# EasyEDA Pro project MINI_FOC.eprj

# Schematic Schematic1
Create Date: 2023-01-16; Page Name: P1; Project Name: MINI_FOC; Schematic Name: Schematic1; Update Date: 2023-01-17; Company: 嘉立创EDA; Page Size: A4; Version: V1.0
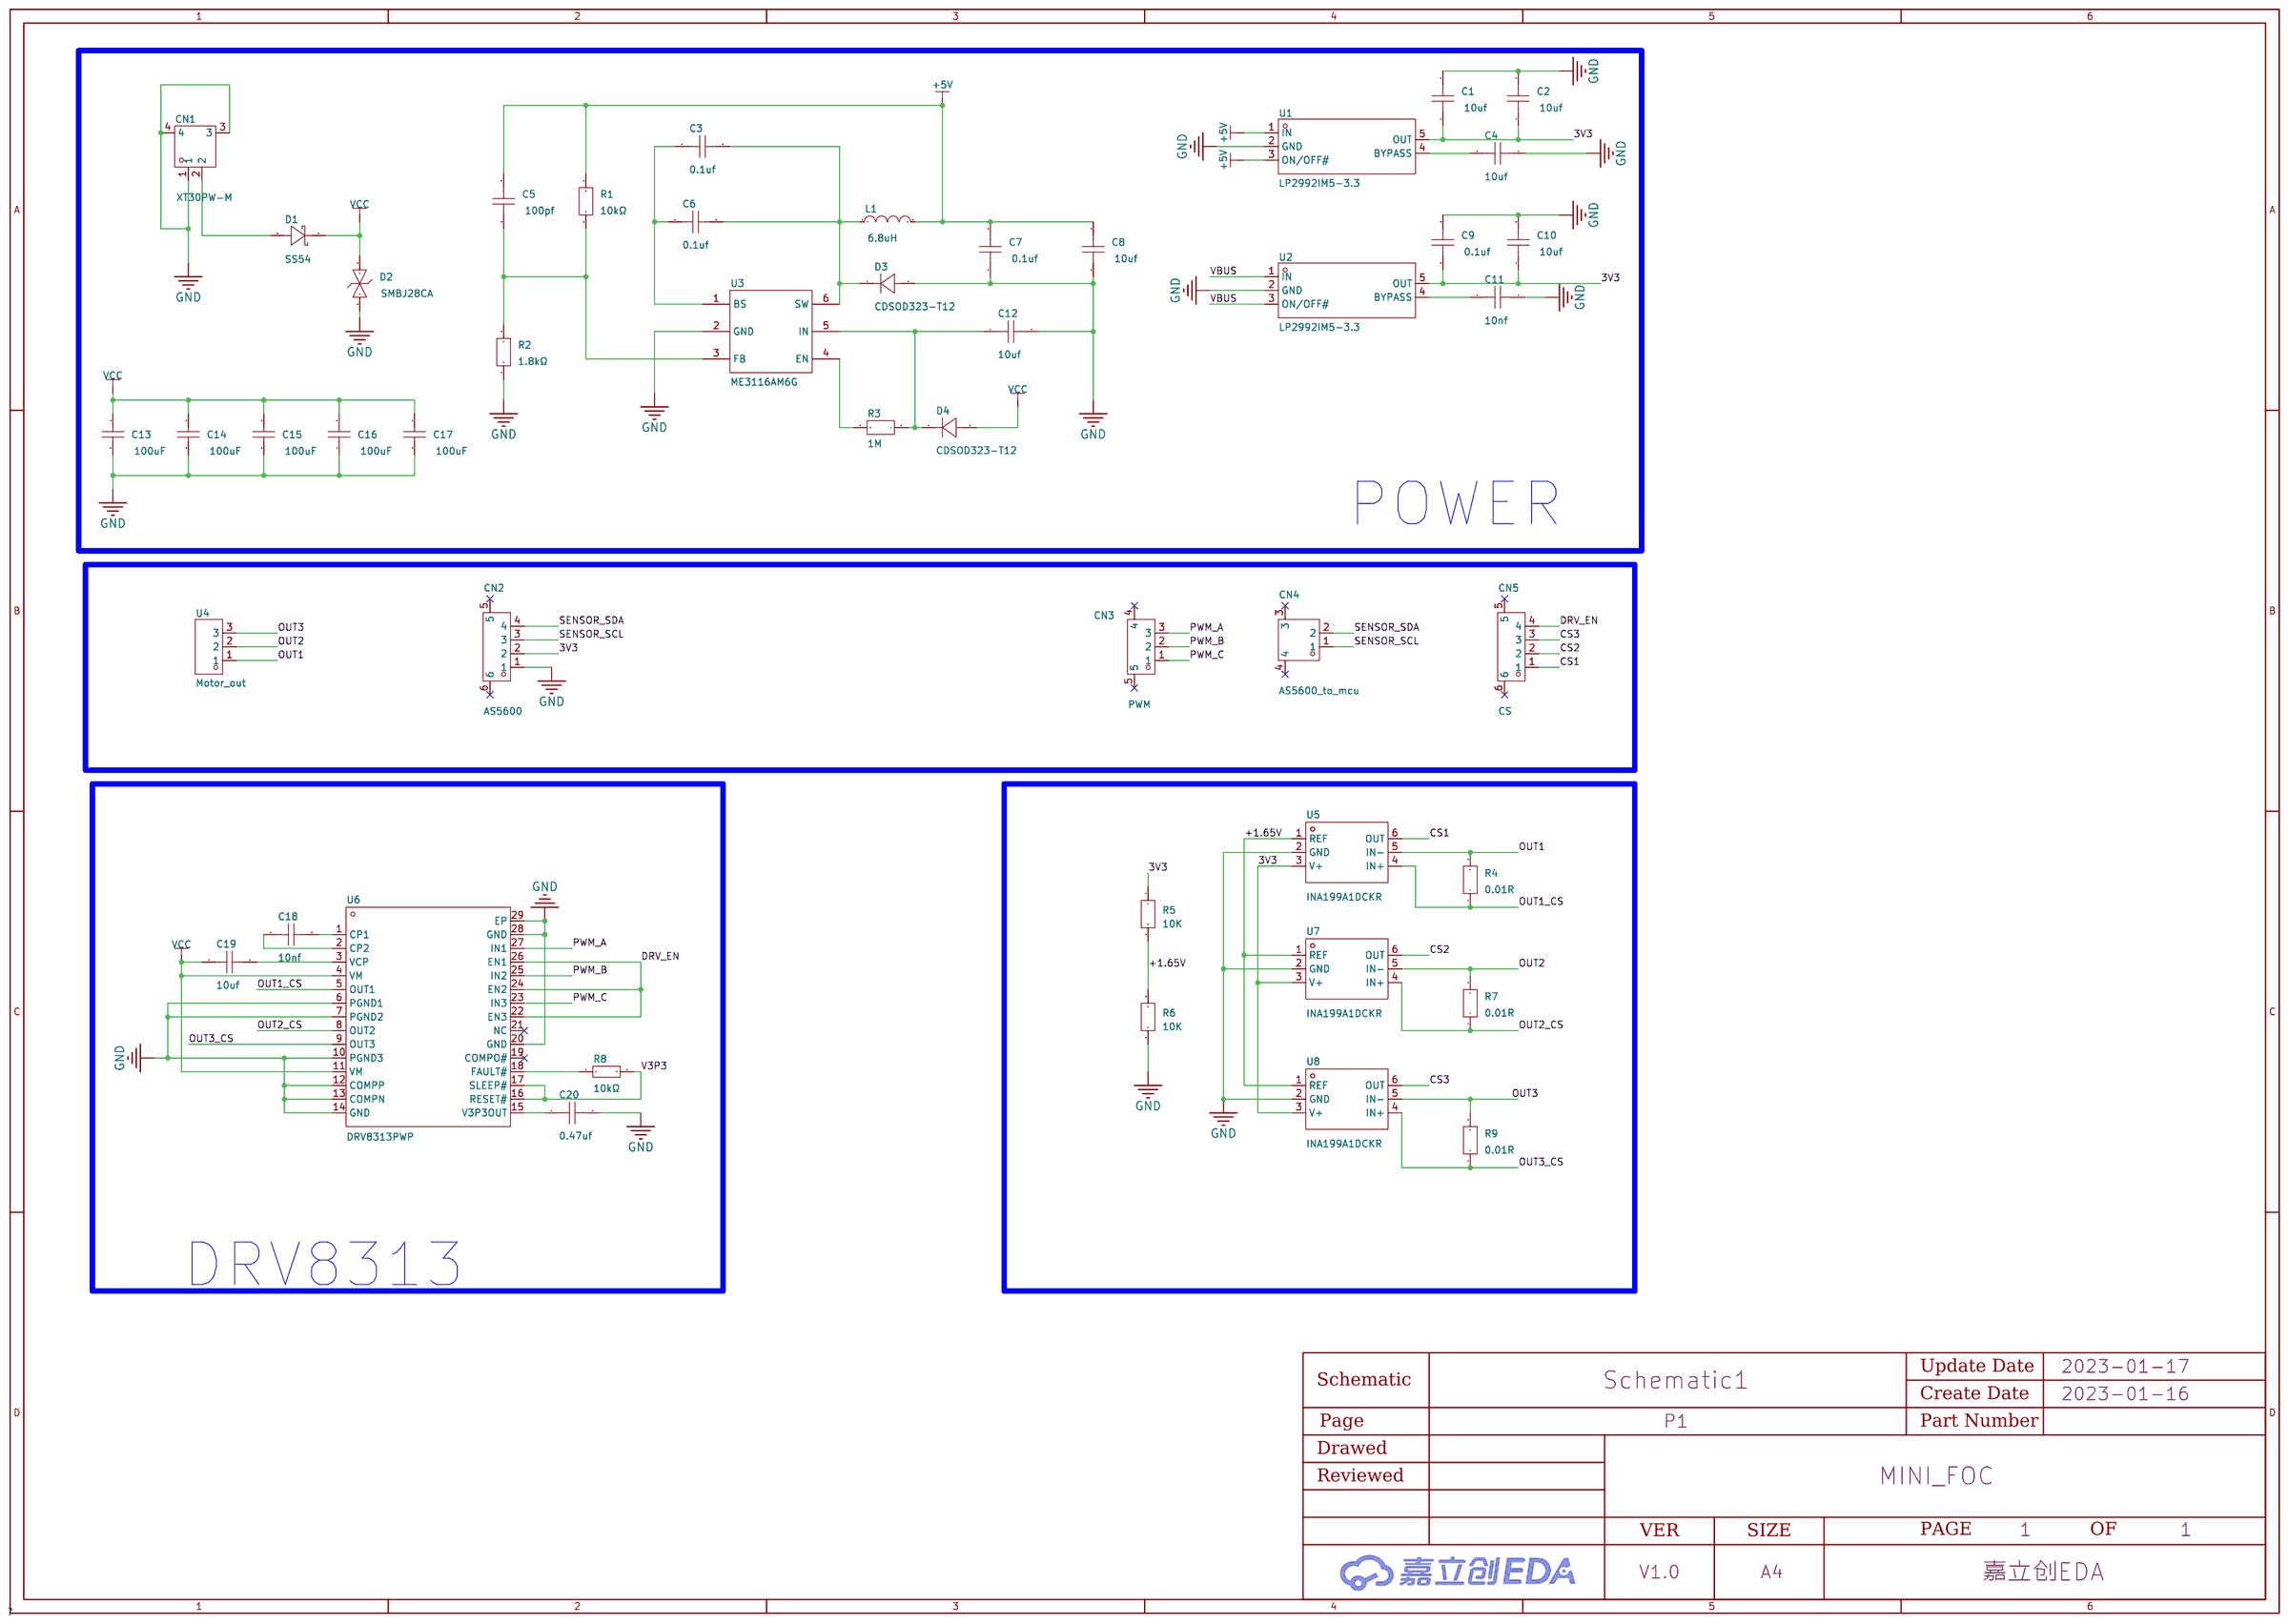
[diagram p0: schematic sheet]

## Parts
C1  10uf  [C0603]
C2  10uf  [C0603]
C3  0.1uf  [C0603]
C4  10uf  [C0603]
C5  100pf  [C0603]
C6  0.1uf  [C0603]
C7  0.1uf  [C0603]
C8  10uf  [C0603]
C9  0.1uf  [C0603]
C10  10uf  [C0603]
C11  10nf  [C0603]
C12  10uf  [C0603]
C13  100uF  [C1206]
C14  100uF  [C1206]
C15  100uF  [C1206]
C16  100uF  [C1206]
C17  100uF  [C1206]
C18  10nf  [C0603]
C19  10uf  [C0603]
C20  0.47uf  [C0603]
CN1  XT30PW-M  [CONN-TH_XT30PW-M]
CN2  AS5600  [CONN-SMD_4P-P1.00_HDGC_HDGC1002WR-S-4P]
CN3  PWM  [CONN-SMD_3P-P1.00_HDGC_1.0K-BH-3PWB]
CN4  AS5600_to_mcu  [CONN-SMD_2P-P1.00_HDGC_1.0K-BH-2PWB]
CN5  CS  [CONN-SMD_4P-P1.00_HDGC_HDGC1002WR-S-4P]
D1  SS54  [DO-214AC_L4.3-W2.7-LS5.2-RD]
D2  SMBJ28CA  [SMB_L4.6-W3.6-LS5.3-BI]
D3  CDSOD323-T12  [SOD-323_L1.8-W1.3-LS2.5-RD]
D4  CDSOD323-T12  [SOD-323_L1.8-W1.3-LS2.5-RD]
L1  6.8uH  [IND-SMD_L2.0-W1.6]
R1  10kΩ  [R0603]
R2  1.8kΩ  [R0603]
R3  1M  [R0603]
R4  0.01R  [R0805]
R5  10K  [R0603]
R6  10K  [R0603]
R7  0.01R  [R0805]
R8  10kΩ  [R0402]
R9  0.01R  [R0805]
U1  LP2992IM5-3.3  [SOT-23-5_L2.9-W1.6-P0.95-LS2.8-BL]
U2  LP2992IM5-3.3  [SOT-23-5_L2.9-W1.6-P0.95-LS2.8-BL]
U3  ME3116AM6G  [SOT-23-6_L2.9-W1.6-P0.95-LS2.8-BR]
U4  Motor_out  [CONN-TH_MR30-M]
U5  INA199A1DCKR  [SC-70-6_L2.2-W1.3-P0.65-LS2.1-BR]
U6  DRV8313PWP  [HTSSOP-28_L9.8-W4.5-P0.65-LS6.6-BL-EP]
U7  INA199A1DCKR  [SC-70-6_L2.2-W1.3-P0.65-LS2.1-BR]
U8  INA199A1DCKR  [SC-70-6_L2.2-W1.3-P0.65-LS2.1-BR]

## Library data of the parts
C1-C12 C18-C20 = CL10B104KB8NNNC: 容值:100nF;精度:±10%;额定电压:50V;材质(温度系数):X7R;; LCSC Part Name: 100nF ±10% 50V; Supplier Part: C1591; Manufacturer: SAMSUNG(三星); Supplier Footprint: 0603; JLCPCB Part Class: 扩展库; Datasheet: https://atta.szlcsc.com/upload/public/pdf/source/20160103/1457707680512.pdf; Supplier: LCSC; Tolerance: ±10%; Voltage Rated: 50V; Temperature Coefficient: X7R
C13-C17 = CL31A107MQHNNNE: 容值:100uF;精度:±20%;额定电压:6.3V;材质(温度系数):X5R;; LCSC Part Name: 100uF ±20% 6.3V; Supplier Part: C15008; Manufacturer: SAMSUNG(三星); Supplier Footprint: 1206; JLCPCB Part Class: 基础库; Datasheet: https://atta.szlcsc.com/upload/public/pdf/source/20160103/1457707673200.pdf; Supplier: LCSC; Tolerance: ±20%; Voltage Rated: 6.3V; Temperature Coefficient: X5R
CN1 = XT30PW-M: Socket,DCsupply,XT30,male,PIN:2; LCSC Part Name: XT30PW-M公头; Supplier Part: C431092; Manufacturer: AMASS(艾迈斯); Supplier Footprint: 插件; JLCPCB Part Class: 扩展库; Datasheet: https://atta.szlcsc.com/upload/public/pdf/source/20220222/6A9F22F7850E25B33E1BE430ADF8560B.pdf; Supplier: LCSC
CN2 CN5 = HDGC1002WR-S-4P: SH1.0针座卧贴 4P; LCSC Part Name: SH1.0针座卧贴 4P; Supplier Part: C2936214; Manufacturer: HDGC(华德共创); Supplier Footprint: SMD,P=1mm; JLCPCB Part Class: 扩展库; Datasheet: https://atta.szlcsc.com/upload/public/pdf/source/20211229/E8A09E85670B5E97244D2008A24D97FE.pdf; Supplier: LCSC
CN3 = 1.0K-BH-3PWB: 1.0间距卧式贴片针座 3P; LCSC Part Name: 1x3P 间距P=1.0mm 卧贴 SMT; Supplier Part: C2919604; Manufacturer: HDGC(华德共创); Supplier Footprint: SMD,P=1mm; JLCPCB Part Class: 扩展库; Datasheet: https://atta.szlcsc.com/upload/public/pdf/source/20211115/0C4A9B301513FDEAA34F959002791CED.pdf; Supplier: LCSC
CN4 = 1.0K-BH-2PWB: 1.0间距卧式贴片针座 2P; LCSC Part Name: 1x2P 间距P=1.0mm 卧贴 SMT; Supplier Part: C2919603; Manufacturer: HDGC(华德共创); Supplier Footprint: SMD,P=1mm; JLCPCB Part Class: 扩展库; Datasheet: https://atta.szlcsc.com/upload/public/pdf/source/20211115/0C4A9B301513FDEAA34F959002791CED.pdf; Supplier: LCSC
D1 = SS54_C2891720: 二极管配置:-;直流反向耐压(Vr):40V;平均整流电流(Io):5A;正向压降(Vf):550mV@5A;反向电流(Ir):500uA@40V;; LCSC Part Name: 40V 5A 550mV@5A SMA; Supplier Part: C2891720; Manufacturer: KUU; Supplier Footprint: SMA(DO-214AC); Datasheet: https://atta.szlcsc.com/upload/public/pdf/source/20210901/BDE5FE02CE1120C497AA935C2B0677B1.pdf; Supplier: LCSC; Reverse Voltage (Vr): 40V; Average Rectified Current (Io): 5A; Forward Voltage (Vf@If): 550mV@5A; Reverse Leakage Current (Ir): 500uA@40V
D2 = SMBJ28CA_C726872: 极性:双向;; LCSC Part Name: 双向; Supplier Part: C726872; Manufacturer: TWGMC(台湾迪嘉); Supplier Footprint: SMB; JLCPCB Part Class: 扩展库; Datasheet: https://atta.szlcsc.com/upload/public/pdf/source/20200901/C726811_07201DC3516E92FF13903A0BAE18F725.pdf; Supplier: LCSC; Polarity: 双向
D3 D4 = CDSOD323-T12: 反向截止电压(Vrwm):12V;击穿电压(VBR):13.3V;峰值脉冲电流(Ipp)@8/20us:11A@(8/20us);钳位电压(Vc)@Ipp:28.3V;峰值脉冲功率(Ppp)@8/20us:350W;结电容(Cj)@1MHz:3pF@1MHz;工作温度:-55℃~+150℃@(Tj);; Supplier Part: C1975233; Manufacturer: BOURNS; Supplier Footprint: SOD-323; JLCPCB Part Class: 扩展库; Datasheet: https://atta.szlcsc.com/upload/public/pdf/source/20200729/C711705_B092C80AA6073E77CC27CA73EB4B9B57.pdf; Supplier: LCSC; Reverse Stand-Off Voltage (Vrwm): 12V; Breakdown Voltage (VBR): 13.3V; Peak Pulse Current(Ipp)@8/20us: 11A@(8/20us); Clamping Voltage@Ipp: 28.3V; Peak Pulse Power(Ppp)@8/20us: 350W; Junction Capacitance(Cj)@1MHz: 3pF@1MHz; Operating Temperature: -55℃~+150℃@(Tj)
L1 = HPI201612-1R5M: 精度:±20%;直流电阻(DCR):86mΩ;电感值:1.5uH;额定电流:1.7A;; LCSC Part Name: 1.5uH ±20%; Supplier Part: C326040; Manufacturer: 3L COILS(三礼); Supplier Footprint: SMD; JLCPCB Part Class: 扩展库; Datasheet: https://atta.szlcsc.com/upload/public/pdf/source/20190327/C326040_F6CD8CDF529C70EE87B7CABDE16BF3F3.pdf; Supplier: LCSC; Height: 1.2mm; Tolerance: ±20%; Width: 1.6mm; DC Resistance (DCR): 86mΩ; Length: 2mm; Rated Current: 1.7A
R1-R3 R5 R6 = ERA3ARB472V: 最大工作电压:75V;工作温度范围:-55℃~+155℃;工作温度范围:-55℃~+155℃;精度:±0.1%;阻值:4.7kΩ;类型:薄膜电阻;功率:100mW;温度系数:±10ppm/K;温度系数:±10ppm/K;; LCSC Part Name: 4.7KΩ ±0.1% 1/10W; Supplier Part: C509091; Manufacturer: PANASONIC(松下); Supplier Footprint: 0603; JLCPCB Part Class: 扩展库; Datasheet: https://atta.szlcsc.com/upload/public/pdf/source/20200407/C509091_BA1790FF67ECCE5D526E030A767C13DB.pdf; Supplier: LCSC; Overload Voltage (Max): 75V; Operating Temperature Range: -55℃~+155℃; Tolerance: ±0.1%; Type: 薄膜电阻; Power(Watts): 100mW; Temperature Coefficient: ±10ppm/K
R4 R7 R9 = ERA6ARB104V: 工作温度范围:-55℃~+155℃;工作温度范围:-55℃~+155℃;精度:±0.1%;最大工作电压:100V;类型:薄膜电阻;功率:125mW;温度系数:±10ppm/K;温度系数:±10ppm/K;阻值:100kΩ;; LCSC Part Name: 100KΩ ±0.1% 1/8W; Supplier Part: C509089; Manufacturer: PANASONIC(松下); Supplier Footprint: 0805; JLCPCB Part Class: 扩展库; Datasheet: https://atta.szlcsc.com/upload/public/pdf/source/20200407/C509089_CAF233FEBB67060CAB00AD625F0D5E9C.pdf; Supplier: LCSC; Operating Temperature Range: -55℃~+155℃; Tolerance: ±0.1%; Overload Voltage (Max): 100V; Type: 薄膜电阻; Power(Watts): 125mW; Temperature Coefficient: ±10ppm/K
R8 = ERA2AEB102X: 电阻类型:薄膜电阻;阻值:1kΩ;精度:±0.1%;功率:63mW;温度系数:±25ppm/K;最大工作电压:50V;工作温度范围:-55℃~+155℃;; LCSC Part Name: 1kΩ ±0.1% 63mW; Supplier Part: C445596; Manufacturer: PANASONIC(松下); Supplier Footprint: 0402; JLCPCB Part Class: 扩展库; Supplier: LCSC; Type: 薄膜电阻; Tolerance: ±0.1%; Power(Watts): 63mW; Temperature Coefficient: ±25ppm/K; Overload Voltage (Max): 50V; Operating Temperature Range: -55℃~+155℃
U1 U2 = LP2992IM5-3.3: 输出类型:固定;输出极性:正;输出通道数:1;最大输入电压:16V;输出电压:3.3V;压差:850mV@(250mA);静态电流(地电流):95uA;输出电流:250mA;电源纹波抑制比(PSRR):45dB@(1kHz);特性:过流保护；过热保护;工作温度:-40℃~+125℃@(Tj);; LCSC Part Name: 正 Vin=16V Vout=3.3V 250mA 45dB@(1kHz); Supplier Part: C3751592; Manufacturer: TI(德州仪器); Supplier Footprint: SOT-23-5; Supplier: LCSC; Output Type: 固定; Output Polarity: 正; Number of Outputs: 1; Maximum Input Voltage: 16V; Output Voltage: 3.3V; Dropout Voltage: 850mV@(250mA); Quiescent Current (Ground Current): 95uA; Output Current: 250mA; Power Supply Rejection Ratio (PSRR): 45dB@(1kHz); Feature: 过流保护；过热保护; Operating Temperature: -40℃~+125℃@(Tj)
U3 = ME3116AM6G_C97643: 功能类型:降压型;同步整流:-;输出通道数:-;拓扑结构:-;输入电压:-;输出电流(最大值):-;开关频率:-;; LCSC Part Name: 降压型; Supplier Part: C97643; Manufacturer: MICRONE(南京微盟); Supplier Footprint: SOT-23-6; JLCPCB Part Class: 扩展库; Datasheet: https://atta.szlcsc.com/upload/public/pdf/source/20170322/1490151692992.pdf; Supplier: LCSC; Function: 降压型
U4 = MR30-M: 模型锂电连接器（两件套） 三芯; LCSC Part Name: MR30-M 两件套; Supplier Part: C99873; Manufacturer: AMASS(艾迈斯); JLCPCB Part Class: 扩展库; Datasheet: https://atta.szlcsc.com/upload/public/pdf/source/20170412/1491969315720.pdf; Supplier: LCSC
U5 U7 U8 = INA199A1DCKR: 工作电压:2.7V~26V;工作电压:2.7V~26V;监控类型:Low/High Side;增益Max(V/V):50;共模输入电压:-0.3V~26V;共模输入电压:-0.3V~26V;; Supplier Part: C59135; Manufacturer: TI(德州仪器); Supplier Footprint: SC-70-6(SOT-363); JLCPCB Part Class: 扩展库; Datasheet: https://atta.szlcsc.com/upload/public/pdf/source/20150921/1457707392422.pdf; Supplier: LCSC; Features: 低侧或高侧,双向,零漂移,宽共模范围; Gain Error(%): ±0.03; Voltage - Supply: 2.7V~26V; Monitor Type: Low/High Side; Amplifier Type: Current Sense; Gain Bandwidth Product: 14kHz; Gain Max(V/V): 50; Common-mode Input Voltage: -0.3V~26V; Number of Channels: 1
U6 = DRV8313PWP: 最大电压为 65V 的 3A 峰值三相电机驱动器 28-HTSSOP -40 to 125; Supplier Part: C2863441; Manufacturer: TI(德州仪器); Supplier Footprint: HTSSOP-28-EP-4.5mm; Supplier: LCSC

## Nets
3V3: C1.1 C2.1 C9.1 C10.1 CN2.2 R5.1 U1.5(OUT) U2.5(OUT) U5.3(V+) U7.3(V+) U8.3(V+)
+1.65V: R5.2 R6.1 U5.1(REF) U7.1(REF) U8.1(REF)
+5V: C5.2 C7.2 C8.2 L1.2 R1.2 U1.1(IN) U1.3(ON/OFF#)
GND: C1.2 C2.2 C4.1 C7.1 C8.1 C9.2 C10.2 C11.1 C12.2 C13.1 C14.1 C15.1 C16.1 C17.1 C20.2 CN1.1 CN1.3 CN1.4 CN2.1 D2.2 D3.2(A) R2.1 R6.2 U1.2(GND) U2.2(GND) U3.2(GND) U5.2(GND) U6.6(PGND1) U6.7(PGND2) U6.10(PGND3) U6.12(COMPP) U6.13(COMPN) U6.14(GND) U6.20(GND) U6.28(GND) U6.29(EP) U7.2(GND) U8.2(GND)
V3P3: R8.2 U6.16(RESET#) U6.17(SLEEP#)
VBUS: U2.1(IN) U2.3(ON/OFF#)
VCC: C13.2 C14.2 C15.2 C16.2 C17.2 C19.1 D1.1(K) D2.1 D4.2(A) U6.4(VM) U6.11(VM)
CS1: CN5.1 U5.6(OUT)
CS2: CN5.2 U7.6(OUT)
CS3: CN5.3 U8.6(OUT)
DRV_EN: CN5.4 U6.22(EN3) U6.24(EN2) U6.26(EN1)
OUT1: R4.2 U4.1 U5.5(IN-)
OUT1_CS: R4.1 U5.4(IN+) U6.5(OUT1)
OUT2: R7.2 U4.2 U7.5(IN-)
OUT2_CS: R7.1 U6.8(OUT2) U7.4(IN+)
OUT3: R9.2 U4.3 U8.5(IN-)
OUT3_CS: R9.1 U6.9(OUT3) U8.4(IN+)
PWM_A: CN3.3 U6.27(IN1)
PWM_B: CN3.2 U6.25(IN2)
PWM_C: CN3.1 U6.23(IN3)
SENSOR_SCL: CN2.3 CN4.1
SENSOR_SDA: CN2.4 CN4.2
$1N181: CN1.2 D1.2(A)
$1N2572: C5.1 R1.1 R2.2 U3.3(FB)
$1N2634: C3.1 C6.1 U3.1(BS)
$1N3341: C3.2 C6.2 D3.1(K) L1.1 U3.6(SW)
$1N3515: R3.2 U3.4(EN)
$1N4260: C12.1 D4.1(K) R3.1 U3.5(IN)
$1N6907: C4.2 U1.4(BYPASS)
$1N7414: C11.2 U2.4(BYPASS)
$1N9997: R8.1 U6.18(FAULT#)
$1N10529: C18.2 U6.1(CP1)
$1N10565: C18.1 U6.2(CP2)
$1N10702: C19.2 U6.3(VCP)
$1N12133: C20.1 U6.15(V3P3OUT)

Not connected (* = marked no-connect by the designer): CN2 5* 6*; CN3 4* 5*; CN4 3* 4*; CN5 5* 6*; U6 19(COMPO#)* 21(NC)*

## Notes on the sheet
- POWER
- DRV8313

# Board PCB1
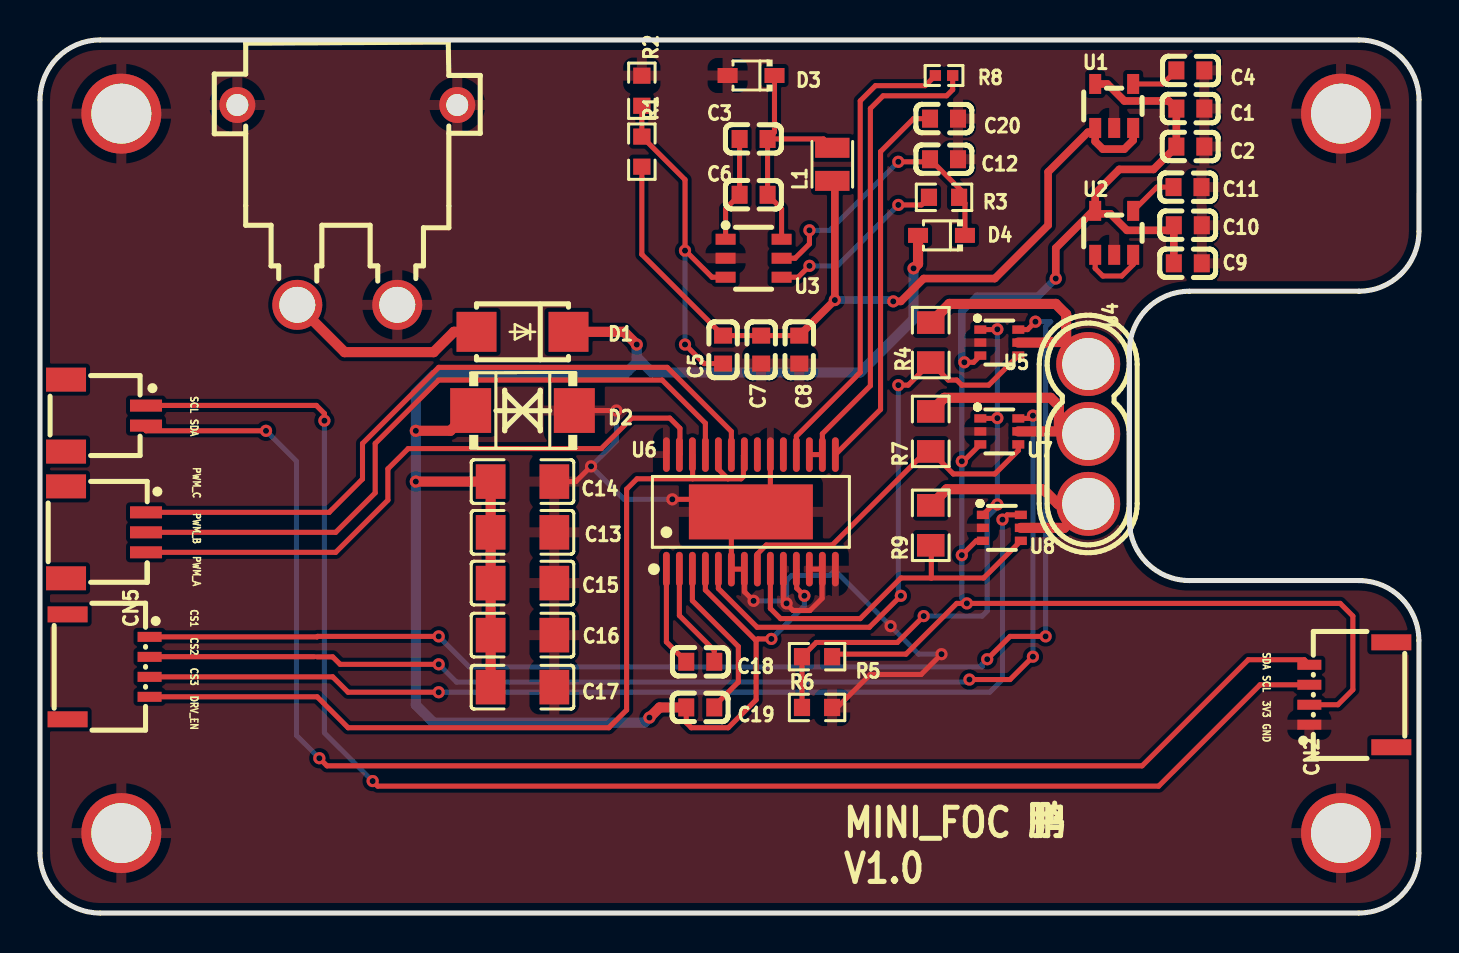
[diagram p1: board, top side]
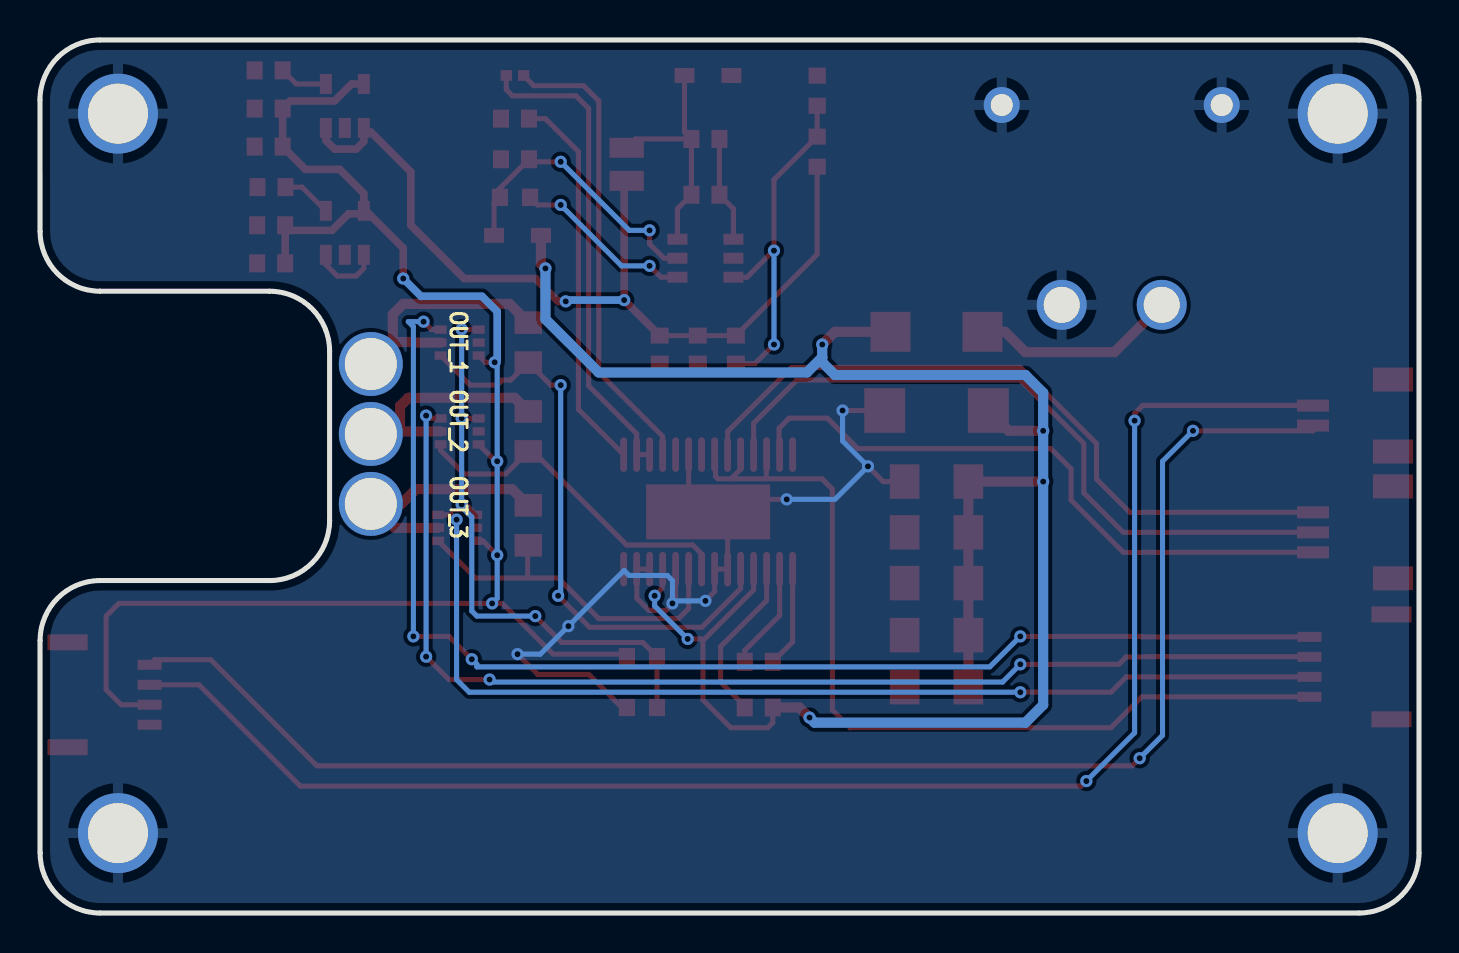
[diagram p2: board, bottom side, seen from below]

Outline 68.97 x 43.69 mm; copper layers: Top Layer, Bottom Layer. Coordinates in mm from the lower left corner of the outline.
Outline path: 0,40.69 0,3 arc(0.88,0.88) 3,0 65.96,0 arc(68.08,0.88) 68.96,3 68.96,13.64 arc(68.08,15.76) 65.96,16.64 57.48,16.64 arc(55.36,17.52) 54.48,19.64 54.48,28.11 arc(55.36,30.24) 57.48,31.11 65.96,31.11 arc(68.08,31.99) 68.96,34.11 68.97,40.69 arc(68.09,42.81) 65.97,43.69 3,43.69 arc(0.88,42.81) 0,40.69
Stack: Top Layer 0.035mm / Dielectric1 1.51mm FR4 er 4.5 / Bottom Layer 0.035mm

## Design rules (mm)
spacing safeClearance (default): track to track 0.152, other pairs 0.152 to 0.3
track width trackWidth (default): min 0.127, default 0.254, max 2.54
differential pair differentialPair (default): width min 0.127, default 0.254, max 2.54; gap min 0.152, default 0.152
via viaSize (default): diameter min 0.5, default 0.61, max 10; hole min 0.3, default 0.305, max 6

## Placement (name value [footprint] x y rotation side)
C1  10uf  [C0603]  57.53 40.25 0 top
C2  10uf  [C0603]  57.53 38.35 0 top
C3  0.1uf  [C0603]  35.69 38.73 0 top
C4  10uf  [C0603]  57.53 42.16 180 top
C5  100pf  [C0603]  34.16 28.19 90 top
C6  0.1uf  [C0603]  35.69 35.94 0 top
C7  0.1uf  [C0603]  36.07 28.19 90 top
C8  10uf  [C0603]  37.97 28.19 90 top
C9  0.1uf  [C0603]  57.4 32.51 0 top
C10  10uf  [C0603]  57.4 34.42 0 top
C11  10nf  [C0603]  57.39 36.33 180 top
C12  10uf  [C0603]  45.21 37.72 0 top
C13  100uF  [C1206]  24.13 19.05 180 top
C14  100uF  [C1206]  24.13 21.59 180 top
C15  100uF  [C1206]  24.13 16.51 180 top
C16  100uF  [C1206]  24.13 13.91 180 top
C17  100uF  [C1206]  24.13 11.3 180 top
C18  10nf  [C0603]  33.02 12.57 180 top
C19  10uf  [C0603]  33.02 10.29 0 top
C20  0.47uf  [C0603]  45.21 39.75 0 top
CN1  XT30PW-M  [CONN-TH_XT30PW-M]  15.37 35.43 180 top
CN2  AS5600  [CONN-SMD_4P-P1.00_HDGC_HDGC1002WR-S-4P]  65.53 10.92 90 top
CN3  PWM  [CONN-SMD_3P-P1.00_HDGC_1.0K-BH-3PWB]  3.3 19.05 270 top
CN4  AS5600_to_mcu  [CONN-SMD_2P-P1.00_HDGC_1.0K-BH-2PWB]  3.3 24.89 270 top
CN5  CS  [CONN-SMD_4P-P1.00_HDGC_HDGC1002WR-S-4P]  3.43 12.32 270 top
D1  SS54  [DO-214AC_L4.3-W2.7-LS5.2-RD]  24.13 29.08 180 top
D2  SMBJ28CA  [SMB_L4.6-W3.6-LS5.3-BI]  24.13 25.15 0 top
D3  CDSOD323-T12  [SOD-323_L1.8-W1.3-LS2.5-RD]  35.56 41.91 180 top
D4  CDSOD323-T12  [SOD-323_L1.8-W1.3-LS2.5-RD]  45.08 33.91 180 top
L1  6.8uH  [IND-SMD_L2.0-W1.6]  39.62 37.47 90 top
NOREF  -  [Pad_e58]  65.07 40 0 top
NOREF#2  -  [Pad_e54]  65.07 4 0 top
NOREF#3  -  [Pad_e29]  4.07 40 0 top
NOREF#4  -  [Pad_e50]  4.07 4 0 top
R1  10kΩ  [R0603]  30.1 38.1 270 top
R2  1.8kΩ  [R0603]  30.1 41.15 270 top
R3  1M  [R0603]  45.21 35.81 180 top
R4  0.01R  [R0805]  44.55 28.55 90 top
R5  10K  [R0603]  38.86 12.83 180 top
R6  10K  [R0603]  38.86 10.29 0 top
R7  0.01R  [R0805]  44.55 24.1 90 top
R8  10kΩ  [R0402]  45.21 41.91 0 top
R9  0.01R  [R0805]  44.55 19.4 90 top
U1  LP2992IM5-3.3  [SOT-23-5_L2.9-W1.6-P0.95-LS2.8-BL]  53.72 40.39 0 top
U2  LP2992IM5-3.3  [SOT-23-5_L2.9-W1.6-P0.95-LS2.8-BL]  53.72 34.04 0 top
U3  ME3116AM6G  [SOT-23-6_L2.9-W1.6-P0.95-LS2.8-BR]  35.69 32.77 180 top
U4  Motor_out  [CONN-TH_MR30-M]  52.42 23.97 270 top
U5  INA199A1DCKR  [SC-70-6_L2.2-W1.3-P0.65-LS2.1-BR]  47.98 28.55 180 top
U6  DRV8313PWP  [HTSSOP-28_L9.8-W4.5-P0.65-LS6.6-BL-EP]  35.55 20.07 0 top
U7  INA199A1DCKR  [SC-70-6_L2.2-W1.3-P0.65-LS2.1-BR]  47.98 24.1 180 top
U8  INA199A1DCKR  [SC-70-6_L2.2-W1.3-P0.65-LS2.1-BR]  48.1 19.27 180 top

## Footprints (pads in the part's own frame, mm; a bottom-side part is the same pattern mirrored in y, then rotated)
C0603
  rect 0.8x0.9 smd: 1(-0.7,0) 2(0.7,0)
C1206
  rect 1.485x1.728 smd: 1(-1.593,0) 2(1.593,0)
CONN-SMD_2P-P1.00_HDGC_1.0K-BH-2PWB
  rect 0.6x1.6 smd: 1(-0.5,2) 2(0.5,2)
  rect 1.2x2 smd: 3(1.8,-2) 4(-1.8,-2)
CONN-SMD_3P-P1.00_HDGC_1.0K-BH-3PWB
  rect 0.6x1.6 smd: 1(-1,2) 2(0,2) 3(1,2)
  rect 1.2x2 smd: 4(2.3,-2) 5(-2.3,-2)
CONN-SMD_4P-P1.00_HDGC_HDGC1002WR-S-4P
  rect 0.5x1.2 smd: 1(-1.5,2.05) 2(-0.5,2.05) 3(0.5,2.05) 4(1.5,2.05)
  rect 0.8x2 smd: 5(2.625,-2.05) 6(-2.625,-2.05)
CONN-TH_MR30-M
  round 3.2 hole 2.6: 1(-3.5,0) 2(0,0) 3(3.5,0)
CONN-TH_XT30PW-M
  round 2.5 hole 1.8: 1(-2.5,5) 2(2.5,5)
  round 1.8 hole 1.1: 3(5.5,-5) 4(-5.5,-5)
DO-214AC_L4.3-W2.7-LS5.2-RD
  rect 2x2 smd: 1(-2.3,0) 2(2.3,0)
HTSSOP-28_L9.8-W4.5-P0.65-LS6.6-BL-EP
  oval 0.343x1.732 smd: 1(-4.225,-2.866) 2(-3.575,-2.866) 3(-2.925,-2.866) 4(-2.275,-2.866) 5(-1.625,-2.866) 6(-0.975,-2.866) 7(-0.325,-2.866) 8(0.325,-2.866) 9(0.975,-2.866) 10(1.625,-2.866) 11(2.275,-2.866) 12(2.925,-2.866) 13(3.575,-2.866) 14(4.225,-2.866) 15(4.225,2.866) 16(3.575,2.866) 17(2.925,2.866) 18(2.275,2.866) 19(1.625,2.866) 20(0.975,2.866) 21(0.325,2.866) 22(-0.325,2.866) 23(-0.975,2.866) 24(-1.625,2.866) 25(-2.275,2.866) 26(-2.925,2.866) 27(-3.575,2.866) 28(-4.225,2.866)
  rect 6.2x2.75 smd: 29(0,0)
IND-SMD_L2.0-W1.6
  rect 1x1.72 smd: 1(0.828,0) 2(-0.828,0)
Pad_e29
  round 4 hole 3: 1(0,0)
Pad_e50
  round 4 hole 3: 1(0,0)
Pad_e54
  round 4 hole 3: 1(0,0)
Pad_e58
  round 4 hole 3: 1(0,0)
R0402
  rect 0.566x0.54 smd: 1(-0.433,0) 2(0.433,0)
R0603
  rect 0.806x0.864 smd: 1(-0.753,0) 2(0.753,0)
R0805
  rect 1.133x1.377 smd: 1(-1,0) 2(1,0)
SC-70-6_L2.2-W1.3-P0.65-LS2.1-BR
  rect 0.6x0.42 smd: 1(0.95,-0.65) 2(0.95,0) 3(0.95,0.65) 4(-0.95,0.65) 5(-0.95,0) 6(-0.95,-0.65)
SMB_L4.6-W3.6-LS5.3-BI
  rect 2.047x2.241 smd: 1(-2.591,0) 2(2.591,0)
SOD-323_L1.8-W1.3-LS2.5-RD
  rect 1x0.75 smd: 1(-1.173,0) 2(1.173,0)
SOT-23-5_L2.9-W1.6-P0.95-LS2.8-BL
  rect 0.6x1 smd: 1(-0.95,-1.1) 2(0,-1.1) 3(0.95,-1.1) 4(0.95,1.1) 5(-0.95,1.1)
SOT-23-6_L2.9-W1.6-P0.95-LS2.8-BR
  rect 1x0.55 smd: 1(1.4,-0.95) 2(1.4,0) 3(1.4,0.95) 4(-1.4,0.95) 5(-1.4,0) 6(-1.4,-0.95)

## Nets
As in the schematic, except:
GND: C1.2 C2.2 C4.1 C7.1 C8.1 C9.2 C10.2 C11.1 C12.2 C13.1 C14.1 C15.1 C16.1 C17.1 C20.2 CN1.1 CN1.3 CN1.4 CN2.1 D2.2 D3.2 NOREF.1 NOREF#2.1 NOREF#3.1 NOREF#4.1 R2.1 R6.2 U1.2 U2.2 U3.2 U5.2 U6.6 U6.7 U6.10 U6.12 U6.13 U6.14 U6.20 U6.28 U6.29 U7.2 U8.2

Pads without a net: CN2 5 6; CN3 4 5; CN4 3 4; CN5 5 6; U6 19 21

## Via types
v1: diameter 0.61, hole 0.305, Top Layer to Bottom Layer, 47 vias

## Routing (per net, layer and track width the routed paths; a pad name or vN(x,y) marks a point on that pad's centre or on a via; arc(x,y) is an arc through that point)
3V3: length 80.5
  Top Layer w0.254: U7.3 46.18,22.61 v1(46.1,22.61) ; v1(46.1,17.91) 46.82,18.62 U8.3 ; v1(46.23,27.56) 46.69,27.56 U5.3 ; CN2.2 64.91,10.42 65.66,11.18 65.66,14.86 65.02,15.49 v1(46.36,15.49) 45.85,15.49 43.31,12.95 39.74,12.95 R5.1
  Top Layer w0.381: C9.1 C10.1 56.45,34.16 54.36,34.16 53.54,34.99 52.77,34.99 ; 52.77,34.99 U2.5 52.77,36.01 53.98,37.21 55.69,37.21 C2.1 C1.1 56.45,40.64 54.23,40.64 53.38,41.49 U1.5 ; 52.77,34.99 52.64,35.12 50.8,33.27 v1(50.8,31.75)
  Bottom Layer w0.254: v1(46.23,27.56) 46.1,27.43 v1(46.1,22.61) v1(46.1,17.91) 46.1,15.75 v1(46.36,15.49)
  Bottom Layer w0.381: v1(46.23,27.56) 46.1,27.69 46.1,30.1 46.86,30.86 49.91,30.86 v1(50.8,31.75)
+1.65V: length 29.7
  Top Layer w0.254: v1(47.88,20.45) 47.68,20.45 U8.1 ; R6.1 R5.2 38.82,13.54 42.88,13.54 v1(44.2,14.86) ; v1(47.88,29.21) 47.86,29.19 U5.1 ; v1(47.88,24.77) 47.86,24.75 U7.1
  Bottom Layer w0.254: v1(44.2,14.86) 47.12,14.86 47.37,15.11 47.37,19.81 47.88,20.32 v1(47.88,20.45) v1(47.88,24.77) v1(47.88,29.21)
+5V: length 44.1
  Top Layer w0.254: C8.2 C7.2 C5.2 30.1,32.96 R1.2
  Top Layer w0.381: U1.1 52.77,39.07 ; 52.77,39.07 52.77,38.61 53.15,38.23 54.23,38.23 54.67,38.67 U1.3 ; 52.77,39.07 52.41,39.07 50.42,37.08 50.42,34.42 47.75,31.75 44.2,31.75 43.05,30.61 v1(42.67,30.61) ; L1.2 39.75,36.51 v1(39.75,30.67) C8.2
  Bottom Layer w0.381: v1(42.67,30.61) 42.61,30.67 v1(39.75,30.67)
GND: length 47.7
  Top Layer w0.254: U6.20 36.53,21.05 36.05,20.57 ; 35.05,19.57 34.58,19.1 U6.6 U6.7 35.23,16.08 v1(35.69,15.62) ; U6.10 37.18,15.62 37.66,15.14 38.51,15.14 39.12,15.75 39.12,17.2 U6.13 U6.12 ; R6.2 39.74,10.16 41.52,11.94 44.07,11.94 v1(45.08,12.95) ; v1(31.62,20.7) 33.92,20.7 34.05,20.57 ; v1(27.56,22.35) 26.8,21.59 C14.1 ; v1(28.83,25.15) D2.2
  Bottom Layer w0.254: v1(31.62,20.7) 29.21,20.7 v1(27.56,22.35) 28.83,23.62 v1(28.83,25.15) ; v1(35.69,15.62) 37.21,15.62 v1(37.34,15.49) 37.34,16.64 37.59,16.89 39.5,16.89 39.75,17.14 v1(42.54,14.36) 43.94,12.95 v1(45.08,12.95)
V3P3: length 24.2
  Top Layer w0.254: R8.2 45.64,41.2 45.34,40.89 42.16,40.89 41.53,40.26 41.53,26.39 39.13,23.98 U6.16 U6.17
VBUS: length 3.5
  Top Layer w0.254: U2.3 54.67,32.45 54.1,31.88 53.15,31.88 52.77,32.26 U2.1
VCC: length 100.5
  Top Layer w0.254: v1(38.23,15.88) 37.85,16.26 37.85,17.19 U6.11 ; 35.81,13.63 35.9,13.72 v1(36.58,13.72) ; 35.81,13.63 35.81,10.67 34.42,9.27 32.57,9.27 32.32,9.53 C19.1 ; 35.81,13.63 33.28,16.16 U6.4
  Top Layer w0.508: D4.2 43.91,32.48 v1(43.69,32.26) ; v1(18.8,24.13) 20.52,24.13 D2.1 ; v1(18.8,21.59) C14.2 C13.2 C15.2 C16.2 C17.2 ; v1(30.48,9.78) 30.99,10.29 C19.1 ; v1(29.85,28.45) 29.21,29.08 D1.1
  Bottom Layer w0.254: v1(38.23,15.88) 38.23,15.37 v1(36.58,13.72)
  Bottom Layer w0.508: v1(30.48,9.78) 30.23,9.53 19.69,9.53 18.8,10.41 v1(18.8,21.59) v1(18.8,24.13) 18.8,26.03 19.69,26.92 29.21,26.92 29.85,27.56 29.85,27.81 ; v1(29.85,28.45) 29.85,27.81 ; 29.85,27.81 30.61,27.05 41.02,27.05 43.69,29.72 v1(43.69,32.26)
CS1: length 63.9
  Top Layer w0.254: 5.35,13.82 13.86,13.82 13.89,13.84 v1(19.94,13.84) ; v1(50.29,13.84) 48.51,13.84 v1(47.37,12.7) ; U5.6 49.39,29.19 v1(49.78,29.59)
  Bottom Layer w0.254: v1(49.78,29.59) 50.55,29.59 50.29,29.34 v1(50.29,13.84) ; v1(19.94,13.84) 21.46,12.32 47.12,12.32 47.12,12.45 v1(47.37,12.7)
CS2: length 58.6
  Top Layer w0.254: U7.6 49.52,24.75 v1(49.66,24.89) ; 5.35,12.82 5.11,12.82 5.11,12.83 13.72,12.83 ; 13.86,12.82 14.64,12.82 15.01,12.45 v1(19.94,12.45) ; v1(46.48,11.68) 48.51,11.68 v1(49.66,12.83)
  Bottom Layer w0.254: v1(46.48,11.68) 46.36,11.56 20.83,11.56 v1(19.94,12.45) ; v1(49.66,24.89) v1(49.66,12.83)
CS3: length 52.4
  Top Layer w0.254: U8.6 48.37,19.92 v1(48.13,19.69) ; 5.35,11.82 14.64,11.82 15.41,11.05 v1(19.94,11.05)
  Bottom Layer w0.254: v1(48.13,19.69) 48.13,11.68 47.5,11.05 v1(19.94,11.05)
DRV_EN: length 45.9
  Top Layer w0.254: 5.35,10.82 13.86,10.82 15.41,9.27 28.45,9.27 29.34,10.16 29.34,21.21 29.86,21.73 32.64,21.73 ; 34.41,21.73 35.06,21.73 35.18,21.84 35.18,22.89 U6.22 ; 34.41,21.73 33.93,22.21 U6.24 ; 34.41,21.73 32.64,21.73 ; 32.64,21.73 32.64,22.93 U6.26
OUT1: length 12.7
  Top Layer w0.508: R4.2 45.48,30.48 50.8,30.48 51.32,29.96 51.32,28.58 ; 51.32,28.58 U4.1 ; 51.32,28.58 50.29,28.58 50.26,28.55 U5.5
OUT1_CS: length 29.5
  Top Layer w0.254: v1(42.93,26.42) 43.42,26.42 R4.1 45.42,26.67 45.85,26.67 46.1,26.42 47.45,26.42 U5.4 ; U6.5 33.93,16.24 35.86,14.3 41.48,14.3 42.93,15.75
  Bottom Layer w0.254: v1(42.93,26.42) 42.93,16 v1(43.05,15.88)
OUT2: length 11.7
  Top Layer w0.508: R7.2 45.23,25.78 50.55,25.78 50.96,25.37 50.96,24.1 ; U7.5 50.96,24.1 ; 50.96,24.1 52.29,24.1 U4.2
OUT2_CS: length 17.2
  Top Layer w0.254: U6.8 35.88,17.97 36.32,18.42 39.62,18.42 44.31,23.1 R7.1 45.68,21.97 47.75,21.97 48.93,23.14 U7.4
OUT3: length 12.4
  Top Layer w0.508: R9.2 45.36,21.21 50.17,21.21 50.9,20.47 U4.3 51.22,19.27 U8.5
OUT3_CS: length 18
  Top Layer w0.254: U8.4 47.19,16.76 44.58,16.76 ; R9.1 44.58,18.37 44.58,16.76 ; 44.58,16.76 43.05,16.76 41.02,14.73 37.04,14.73 36.53,15.24 U6.9
PWM_A: length 32.2
  Top Layer w0.254: 5.05,18.05 14.79,18.05 17.4,20.66 17.4,22.22 18.42,23.24 28.07,23.24 29.59,24.77 31.5,24.77 32,24.26 32,22.97 U6.27
PWM_B: length 35.3
  Top Layer w0.254: U6.25 33.28,24.51 31.11,26.67 19.94,26.67 16.76,23.5 16.76,21.03 14.79,19.05 5.05,19.05
PWM_C: length 36.1
  Top Layer w0.254: U6.23 34.58,24.1 31.37,27.31 19.94,27.31 16.13,23.5 16.13,21.72 14.46,20.05 5.05,20.05
SENSOR_SCL: length 77.8
  Top Layer w0.254: v1(16.64,6.6) 16.89,6.35 55.95,6.35 61.02,11.42 CN2.3 ; 13.82,25.4 13.81,25.39 ; 13.82,25.4 14.22,25 v1(14.22,24.64) ; 13.82,25.4 5.06,25.4 5.05,25.39
  Bottom Layer w0.254: v1(16.64,6.6) 14.22,9.02 v1(14.22,24.64)
SENSOR_SDA: length 75.8
  Top Layer w0.254: CN2.4 63.23,12.68 60.43,12.68 55.12,7.37 14.35,7.37 v1(13.97,7.75) ; v1(11.3,24.13) 5.31,24.13 5.05,24.39
  Bottom Layer w0.254: v1(13.97,7.75) 12.83,8.89 12.83,22.61 v1(11.3,24.13)
$1N181: length 10.4
  Top Layer w0.508: CN1.2 15.23,28.07 19.69,28.07 20.7,29.08 D1.2
$1N2572: length 17.7
  Top Layer w0.254: v1(32.26,28.45) 33.21,27.49 C5.1 ; R2.2 R1.1 32.26,36.69 32.26,33.17 33.61,31.82 U3.3
  Bottom Layer w0.254: v1(32.26,28.45) v1(32.26,33.15)
$1N2634: length 5.3
  Top Layer w0.254: C3.1 C6.1 34.29,35.24 U3.1
$1N3341: length 12
  Top Layer w0.254: C3.2 C6.2 37.09,35.24 U3.6 ; C3.2 36.73,39.08 D3.1 ; C3.2 39.18,38.73 L1.1
$1N3515: length 9
  Top Layer w0.254: R3.2 44.08,35.43 v1(42.93,35.43) ; U3.4 37.91,31.82 v1(38.48,32.39)
  Bottom Layer w0.254: v1(38.48,32.39) 39.88,32.39 v1(42.93,35.43)
$1N4260: length 14.6
  Top Layer w0.254: v1(38.48,34.16) 38.48,33.48 37.77,32.77 U3.5 ; D4.1 46.26,35.52 R3.1 46.19,36.04 C12.1 44.39,37.59 v1(42.93,37.59)
  Bottom Layer w0.254: v1(38.48,34.16) 39.5,34.16 v1(42.93,37.59)
$1N6907: length 2.4
  Top Layer w0.254: U1.4 56.15,41.49 C4.2
$1N7414: length 2.5
  Top Layer w0.254: C11.2 55.86,36.33 U2.4
$1N9997: length 23.3
  Top Layer w0.254: U6.18 37.83,23.86 41.02,27.05 41.02,40.64 41.78,41.4 44.27,41.4 R8.1
$1N10529: length 5
  Top Layer w0.254: U6.1 31.33,13.57 C18.2
$1N10565: length 5.4
  Top Layer w0.254: C18.1 33.72,13.14 31.98,14.89 U6.2
$1N10702: length 8.4
  Top Layer w0.254: U6.3 32.63,15.63 34.92,13.33 34.92,11.56 33.72,10.35 C19.2
$1N12133: length 19.3
  Top Layer w0.254: C20.1 43.69,39.75 42.04,38.1 42.04,25.2 U6.15

## Copper pours and planes (outline as drawn; the poured copper is in the pictures)
GND on Top Layer: 68.97,40.69 68.09,42.81 65.97,43.69 3,43.69 0.88,42.81 0,40.69 0,3 0.88,0.88 3,0 65.96,0 68.08,0.88 68.96,3 68.96,13.64 68.08,15.76 65.96,16.64 57.48,16.64 55.36,17.52 54.48,19.64 54.48,28.11 55.36,30.24 57.48,31.11 65.96,31.11 68.08,31.99 68.96,34.11
GND on Bottom Layer: 68.97,40.69 68.09,42.81 65.97,43.69 3,43.69 0.88,42.81 0,40.69 0,3 0.88,0.88 3,0 65.96,0 68.08,0.88 68.96,3 68.96,13.64 68.08,15.76 65.96,16.64 57.48,16.64 55.36,17.52 54.48,19.64 54.48,28.11 55.36,30.24 57.48,31.11 65.96,31.11 68.08,31.99 68.96,34.11

## Text on the board
Bottom Silkscreen Layer: OUT_1 | OUT_2 | OUT_3
Top Silkscreen Layer: SCL | SDA | CS1 | CS2 | CS3 | DRV_EN | PWM_C | PWM_B | PWM_A | 3V3 | GND | MINI_FOC 鹏 / V1.0
